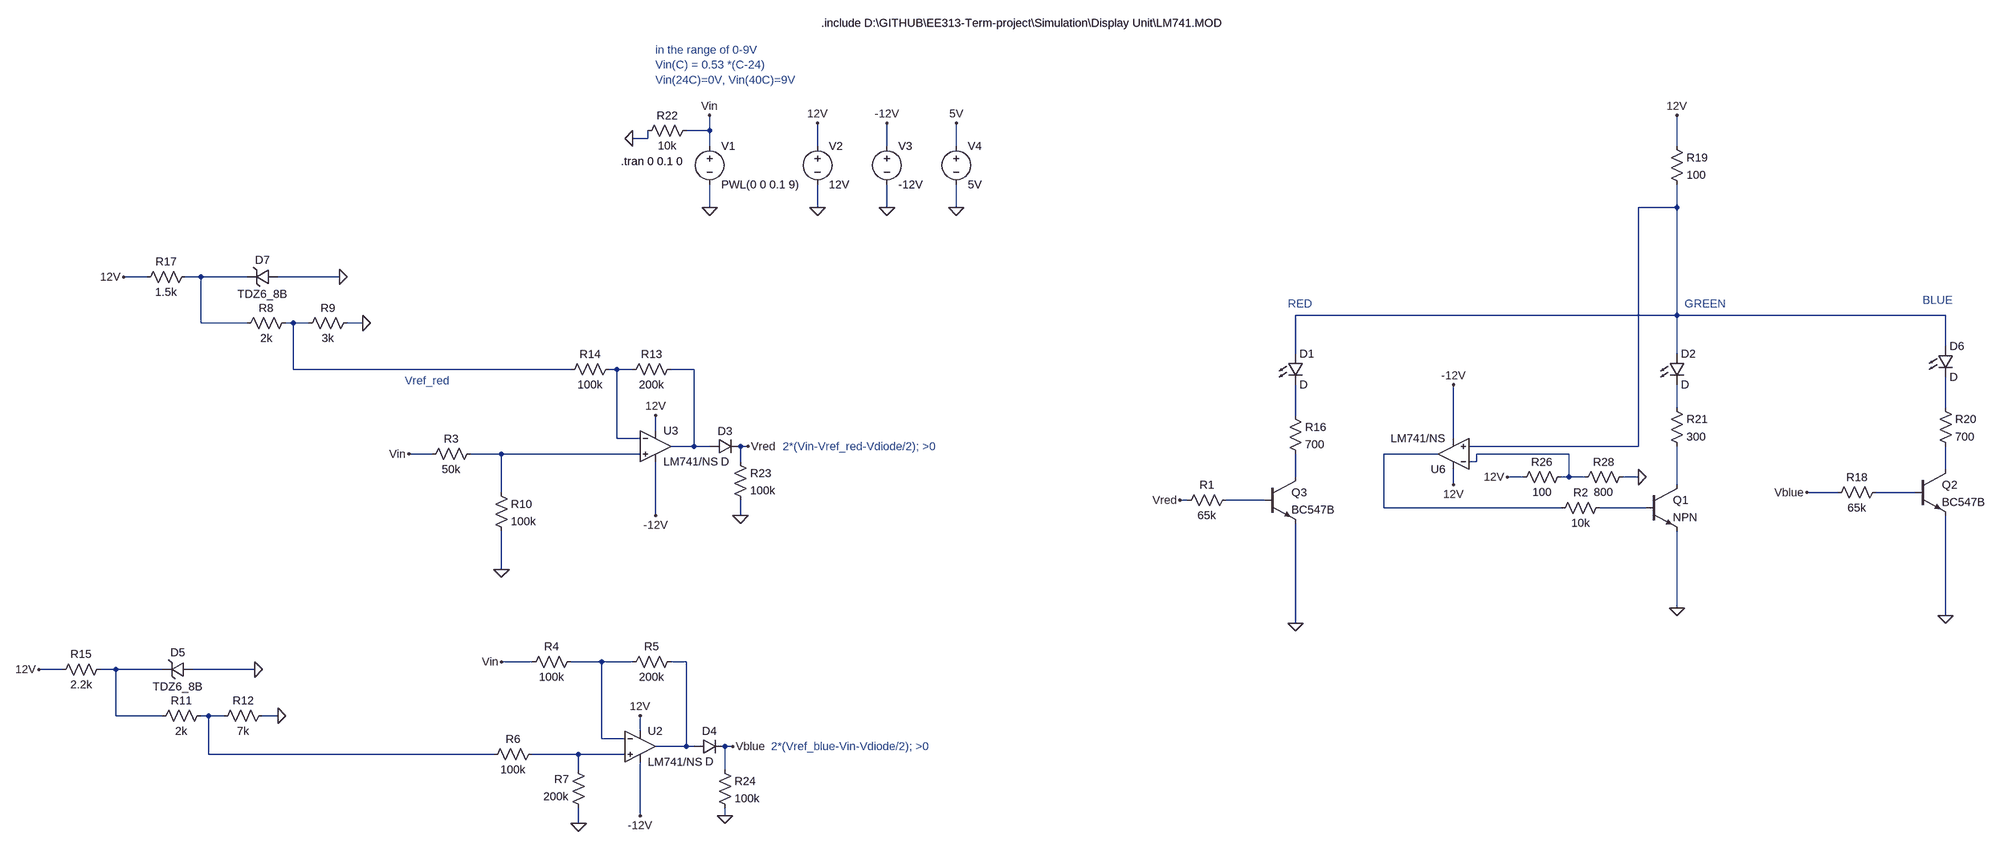
[diagram p0: schematic Display Unit.asc]
Display Unit.asc, the LTspice schematic file:
Version 4
SHEET 1 4272 2752
WIRE -912 288 -912 256
WIRE -912 288 -960 288
WIRE -1040 304 -1040 288
WIRE -1040 304 -1072 304
WIRE -912 320 -912 288
WIRE -688 320 -688 272
WIRE -544 320 -544 272
WIRE -400 320 -400 272
WIRE 1104 320 1104 256
WIRE -912 448 -912 400
WIRE -688 448 -688 400
WIRE -544 448 -544 400
WIRE -400 448 -400 400
WIRE 1104 448 1104 400
WIRE 1104 448 1024 448
WIRE -2080 592 -2128 592
WIRE -1968 592 -2000 592
WIRE -1872 592 -1968 592
WIRE -1680 592 -1808 592
WIRE 1104 672 1104 448
WIRE 1104 672 304 672
WIRE 2000 672 1104 672
WIRE -1968 688 -1968 592
WIRE -1872 688 -1968 688
WIRE -1776 688 -1792 688
WIRE -1744 688 -1776 688
WIRE -1632 688 -1664 688
WIRE 2000 736 2000 672
WIRE 304 752 304 672
WIRE 1104 752 1104 672
WIRE -1776 784 -1776 688
WIRE -1200 784 -1776 784
WIRE -1104 784 -1120 784
WIRE -1072 784 -1104 784
WIRE -944 784 -992 784
WIRE 1104 864 1104 816
WIRE 2000 864 2000 800
WIRE 304 880 304 816
WIRE -1024 912 -1024 880
WIRE -1104 928 -1104 784
WIRE -1056 928 -1104 928
WIRE 640 928 640 816
WIRE -944 944 -944 784
WIRE -944 944 -992 944
WIRE -912 944 -944 944
WIRE -832 944 -848 944
WIRE 1024 944 1024 448
WIRE 1024 944 672 944
WIRE -1488 960 -1536 960
WIRE -1344 960 -1408 960
WIRE -1056 960 -1344 960
WIRE 608 960 496 960
WIRE 880 960 688 960
WIRE -848 976 -848 944
WIRE 688 976 688 960
WIRE 688 976 672 976
WIRE 2000 992 2000 944
WIRE 304 1008 304 960
WIRE 784 1008 752 1008
WIRE 880 1008 880 960
WIRE 880 1008 864 1008
WIRE 912 1008 880 1008
WIRE 1024 1008 992 1008
WIRE 640 1024 640 992
WIRE 1104 1024 1104 944
WIRE -1344 1040 -1344 960
WIRE 1776 1040 1712 1040
WIRE 1936 1040 1856 1040
WIRE 80 1056 64 1056
WIRE 240 1056 160 1056
WIRE 496 1072 496 960
WIRE 864 1072 496 1072
WIRE 1040 1072 944 1072
WIRE -1024 1088 -1024 976
WIRE -848 1088 -848 1056
WIRE -1344 1200 -1344 1120
WIRE 1104 1280 1104 1120
WIRE 2000 1296 2000 1088
WIRE 304 1312 304 1104
WIRE -1280 1392 -1344 1392
WIRE -1136 1392 -1200 1392
WIRE -1072 1392 -1136 1392
WIRE -960 1392 -992 1392
WIRE -2256 1408 -2304 1408
WIRE -2144 1408 -2176 1408
WIRE -2048 1408 -2144 1408
WIRE -1856 1408 -1984 1408
WIRE -2144 1504 -2144 1408
WIRE -2048 1504 -2144 1504
WIRE -1952 1504 -1968 1504
WIRE -1920 1504 -1952 1504
WIRE -1808 1504 -1840 1504
WIRE -1056 1536 -1056 1504
WIRE -1136 1552 -1136 1392
WIRE -1088 1552 -1136 1552
WIRE -960 1568 -960 1392
WIRE -960 1568 -1024 1568
WIRE -944 1568 -960 1568
WIRE -864 1568 -880 1568
WIRE -1952 1584 -1952 1504
WIRE -1360 1584 -1952 1584
WIRE -1184 1584 -1280 1584
WIRE -1088 1584 -1184 1584
WIRE -1184 1616 -1184 1584
WIRE -880 1616 -880 1568
WIRE -1056 1712 -1056 1600
WIRE -880 1712 -880 1696
WIRE -1184 1728 -1184 1696
FLAG -912 448 0
FLAG -912 256 Vin
FLAG -688 448 0
FLAG -688 272 12V
FLAG 304 1312 0
FLAG -544 448 0
FLAG -544 272 -12V
FLAG -400 448 0
FLAG -400 272 5V
FLAG -1024 880 12V
FLAG -1344 1200 0
FLAG -832 944 Vred
FLAG -1536 960 Vin
FLAG -1056 1504 12V
FLAG -864 1568 Vblue
FLAG -1184 1728 0
FLAG -1344 1392 Vin
FLAG -1024 1088 -12V
FLAG -1056 1712 -12V
FLAG 2000 1296 0
FLAG -848 1088 0
FLAG -880 1712 0
FLAG 1104 256 12V
FLAG -1632 688 0
FLAG -1680 592 0
FLAG -2128 592 12V
FLAG -1808 1504 0
FLAG -1856 1408 0
FLAG -2304 1408 12V
FLAG 640 1024 12V
FLAG 640 816 -12V
FLAG 1024 1008 0
FLAG 752 1008 12V
FLAG 1104 1280 0
FLAG 64 1056 Vred
FLAG 1712 1040 Vblue
FLAG -1072 304 0
SYMBOL voltage -912 304 R0
WINDOW 123 0 0 Left 0
WINDOW 39 0 0 Left 0
SYMATTR InstName V1
SYMATTR Value PWL(0 0 0.1 9)
SYMBOL voltage -688 304 R0
WINDOW 123 0 0 Left 0
WINDOW 39 0 0 Left 0
SYMATTR InstName V2
SYMATTR Value 12V
SYMBOL LED 288 752 R0
SYMATTR InstName D1
SYMBOL voltage -544 304 R0
WINDOW 123 0 0 Left 0
WINDOW 39 0 0 Left 0
SYMATTR InstName V3
SYMATTR Value -12V
SYMBOL voltage -400 304 R0
WINDOW 123 0 0 Left 0
WINDOW 39 0 0 Left 0
SYMATTR InstName V4
SYMATTR Value 5V
SYMBOL OpAmps\\opamp2 -1024 880 R0
SYMATTR InstName U3
SYMATTR Value LM741/NS
SYMBOL res -1360 1024 R0
SYMATTR InstName R10
SYMATTR Value 100k
SYMBOL res -976 768 R90
WINDOW 0 0 56 VBottom 2
WINDOW 3 32 56 VTop 2
SYMATTR InstName R13
SYMATTR Value 200k
SYMBOL res -1216 800 R270
WINDOW 0 32 56 VTop 2
WINDOW 3 0 56 VBottom 2
SYMATTR InstName R14
SYMATTR Value 100k
SYMBOL res -1392 944 R90
WINDOW 0 0 56 VBottom 2
WINDOW 3 32 56 VTop 2
SYMATTR InstName R3
SYMATTR Value 50k
SYMBOL OpAmps\\opamp2 -1056 1504 R0
SYMATTR InstName U2
SYMATTR Value LM741/NS
SYMBOL LED 1088 752 R0
SYMATTR InstName D2
SYMBOL res -1184 1376 R90
WINDOW 0 0 56 VBottom 2
WINDOW 3 32 56 VTop 2
SYMATTR InstName R4
SYMATTR Value 100k
SYMBOL res -976 1376 R90
WINDOW 0 0 56 VBottom 2
WINDOW 3 32 56 VTop 2
SYMATTR InstName R5
SYMATTR Value 200k
SYMBOL res -1264 1568 R90
WINDOW 0 0 56 VBottom 2
WINDOW 3 32 56 VTop 2
SYMATTR InstName R6
SYMATTR Value 100k
SYMBOL res -1168 1712 R180
WINDOW 0 36 76 Left 2
WINDOW 3 36 40 Left 2
SYMATTR InstName R7
SYMATTR Value 200k
SYMBOL diode -912 960 R270
WINDOW 0 32 32 VTop 2
WINDOW 3 0 32 VBottom 2
SYMATTR InstName D3
SYMBOL diode -944 1584 R270
WINDOW 0 32 32 VTop 2
WINDOW 3 0 32 VBottom 2
SYMATTR InstName D4
SYMBOL LED 1984 736 R0
SYMATTR InstName D6
SYMBOL res -864 960 R0
SYMATTR InstName R23
SYMATTR Value 100k
SYMBOL res -896 1600 R0
SYMATTR InstName R24
SYMATTR Value 100k
SYMBOL zener -1808 576 R90
WINDOW 0 -4 32 VBottom 2
WINDOW 3 36 32 VTop 2
SYMATTR InstName D7
SYMATTR Value TDZ6_8B
SYMBOL res -1776 672 R90
WINDOW 0 0 56 VBottom 2
WINDOW 3 32 56 VTop 2
SYMATTR InstName R8
SYMATTR Value 2k
SYMBOL res -1648 672 R90
WINDOW 0 0 56 VBottom 2
WINDOW 3 32 56 VTop 2
SYMATTR InstName R9
SYMATTR Value 3k
SYMBOL res -1984 576 R90
WINDOW 0 0 56 VBottom 2
WINDOW 3 32 56 VTop 2
SYMATTR InstName R17
SYMATTR Value 1.5k
SYMBOL zener -1984 1392 R90
WINDOW 0 -4 32 VBottom 2
WINDOW 3 36 32 VTop 2
SYMATTR InstName D5
SYMATTR Value TDZ6_8B
SYMBOL res -1952 1488 R90
WINDOW 0 0 56 VBottom 2
WINDOW 3 32 56 VTop 2
SYMATTR InstName R11
SYMATTR Value 2k
SYMBOL res -1824 1488 R90
WINDOW 0 0 56 VBottom 2
WINDOW 3 32 56 VTop 2
SYMATTR InstName R12
SYMATTR Value 7k
SYMBOL res -2160 1392 R90
WINDOW 0 0 56 VBottom 2
WINDOW 3 32 56 VTop 2
SYMATTR InstName R15
SYMATTR Value 2.2k
SYMBOL res 1088 304 R0
SYMATTR InstName R19
SYMATTR Value 100
SYMBOL OpAmps\\opamp2 640 1024 R180
SYMATTR InstName U6
SYMATTR Value LM741/NS
SYMBOL res 880 992 R90
WINDOW 0 0 56 VBottom 2
WINDOW 3 32 56 VTop 2
SYMATTR InstName R26
SYMATTR Value 100
SYMBOL res 1008 992 R90
WINDOW 0 0 56 VBottom 2
WINDOW 3 32 56 VTop 2
SYMATTR InstName R28
SYMATTR Value 800
SYMBOL npn 240 1008 R0
SYMATTR InstName Q3
SYMATTR Value BC547B
SYMBOL npn 1040 1024 R0
SYMATTR InstName Q1
SYMBOL res 960 1056 R90
WINDOW 0 0 56 VBottom 2
WINDOW 3 32 56 VTop 2
SYMATTR InstName R2
SYMATTR Value 10k
SYMBOL res 176 1040 R90
WINDOW 0 0 56 VBottom 2
WINDOW 3 32 56 VTop 2
SYMATTR InstName R1
SYMATTR Value 65k
SYMBOL res 288 864 R0
SYMATTR InstName R16
SYMATTR Value 700
SYMBOL res 1984 848 R0
SYMATTR InstName R20
SYMATTR Value 700
SYMBOL res 1872 1024 R90
WINDOW 0 0 56 VBottom 2
WINDOW 3 32 56 VTop 2
SYMATTR InstName R18
SYMATTR Value 65k
SYMBOL npn 1936 992 R0
SYMATTR InstName Q2
SYMATTR Value BC547B
SYMBOL res 1088 848 R0
SYMATTR InstName R21
SYMATTR Value 300
SYMBOL res -944 272 R90
WINDOW 0 0 56 VBottom 2
WINDOW 3 32 56 VTop 2
SYMATTR InstName R22
SYMATTR Value 10k
TEXT -680 64 Left 2 !.include D:\\GITHUB\\EE313-Term-project\\Simulation\\Display Unit\\LM741.MOD
TEXT -1096 352 Left 2 !.tran 0 0.1 0
TEXT -1024 120 Left 2 ;in the range of 0-9V\nVin(C) = 0.53 *(C-24)\nVin(24C)=0V, Vin(40C)=9V
TEXT -760 944 Left 2 ;2*(Vin-Vref_red-Vdiode/2); >0
TEXT -784 1568 Left 2 ;2*(Vref_blue-Vin-Vdiode/2); >0
TEXT -1544 808 Left 2 ;Vref_red
TEXT 288 648 Left 2 ;RED
TEXT 1120 648 Left 2 ;GREEN
TEXT 1952 640 Left 2 ;BLUE

The netlist it stands for:
* Display Unit.asc
V1 Vin 0 PWL(0 0 0.1 9)
V2 12V 0 12V
D1 N001 N008 D
V3 -12V 0 -12V
V4 5V 0 5V
XU3 N009 N004 12V -12V N005 LM741/NS  ; pins In+ In- V+ V- OUT
R10 N009 0 100k
R13 N005 N004 200k
R14 N003 N004 100k
R3 N009 Vin 50k
XU2 N022 N018 12V -12V N019 LM741/NS  ; pins In+ In- V+ V- OUT
D2 N001 N006 D
R4 N018 Vin 100k
R5 N019 N018 200k
R6 N022 N021 100k
R7 0 N022 200k
D3 N005 Vred D
D4 N019 Vblue D
D6 N001 N007 D
R23 Vred 0 100k
R24 Vblue 0 100k
D7 0 N002 TDZ6_8B
R8 N003 N002 2k
R9 0 N003 3k
R17 N002 12V 1.5k
D5 0 N020 TDZ6_8B
R11 N021 N020 2k
R12 0 N021 7k
R15 N020 12V 2.2k
R19 12V N001 100
XU6 N001 N011 12V -12V N010 LM741/NS  ; pins In+ In- V+ V- OUT
R26 N011 12V 100
R28 0 N011 800
Q3 N013 N016 0 0 BC547B
Q1 N014 N017 0 0 NPN
R2 N017 N010 10k
R1 N016 Vred 65k
R16 N008 N013 700
R20 N007 N012 700
R18 N015 Vblue 65k
Q2 N012 N015 0 0 BC547B
R21 N006 N014 300
R22 Vin 0 10k
.model D D
.lib standard.dio
.model NPN NPN
.model PNP PNP
.lib standard.bjt
.include D:\GITHUB\EE313-Term-project\Simulation\Display Unit\LM741.MOD
.tran 0 0.1 0
* in the range of 0-9V
* Vin(C) = 0.53 *(C-24)
* Vin(24C)=0V, Vin(40C)=9V
* 2*(Vin-Vref_red-Vdiode/2); >0
* 2*(Vref_blue-Vin-Vdiode/2); >0
* Vref_red
* RED
* GREEN
* BLUE
.backanno
.end